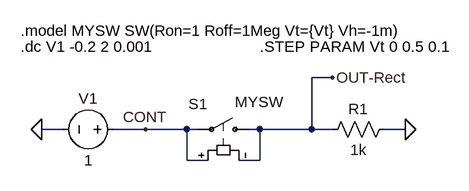
[diagram p0: schematic Fig_2-113_IdealDiode_SW.asc]
Fig_2-113_IdealDiode_SW.asc, the LTspice schematic file:
Version 4
SHEET 1 880 680
WIRE 432 128 400 128
WIRE 16 208 -16 208
WIRE 144 208 96 208
WIRE 208 208 144 208
WIRE 224 208 208 208
WIRE 320 208 304 208
WIRE 400 208 400 128
WIRE 400 208 320 208
WIRE 432 208 400 208
WIRE 544 208 512 208
WIRE 208 256 208 208
WIRE 240 256 208 256
WIRE 320 256 320 208
WIRE 320 256 288 256
FLAG -16 208 0
FLAG 544 208 0
FLAG 432 128 OUT-Rect
FLAG 144 208 CONT
SYMBOL voltage 112 208 R90
WINDOW 0 -32 56 VBottom 2
WINDOW 3 32 56 VTop 2
WINDOW 123 0 0 Left 0
WINDOW 39 60 56 VTop 2
SYMATTR InstName V1
SYMATTR Value 1
SYMBOL sw 320 208 M270
WINDOW 0 39 110 VLeft 2
WINDOW 3 42 38 VLeft 2
SYMATTR InstName S1
SYMATTR Value MYSW
SYMBOL res 416 224 R270
WINDOW 0 32 56 VTop 2
WINDOW 3 0 56 VBottom 2
SYMATTR InstName R1
SYMATTR Value 1k
TEXT -48 56 Left 2 !.model MYSW SW(Ron=1 Roff=1Meg Vt={Vt} Vh=-1m)
TEXT -48 80 Left 2 !.dc V1 -0.2 2 0.001
TEXT 320 80 Left 2 !.STEP PARAM Vt 0 0.5 0.1

The netlist it stands for:
* Fig_2-113_IdealDiode_SW.asc
V1 CONT 0 1
S1 OUT-Rect CONT CONT OUT-Rect MYSW
R1 OUT-Rect 0 1k
.model MYSW SW(Ron=1 Roff=1Meg Vt={Vt} Vh=-1m)
.dc V1 -0.2 2 0.001
.STEP PARAM Vt 0 0.5 0.1
.backanno
.end